# EasyEDA Pro project glimmer.epro, schematic Inputs
Board Name: Inputs; Create Date: 2026-05-20; Page Name: Inputs; Project Name: glimmer; Schematic Name: Inputs; Update Date: 2026-05-20; Company: EasyEDA.com; Page Size: A4; Version: V1.0
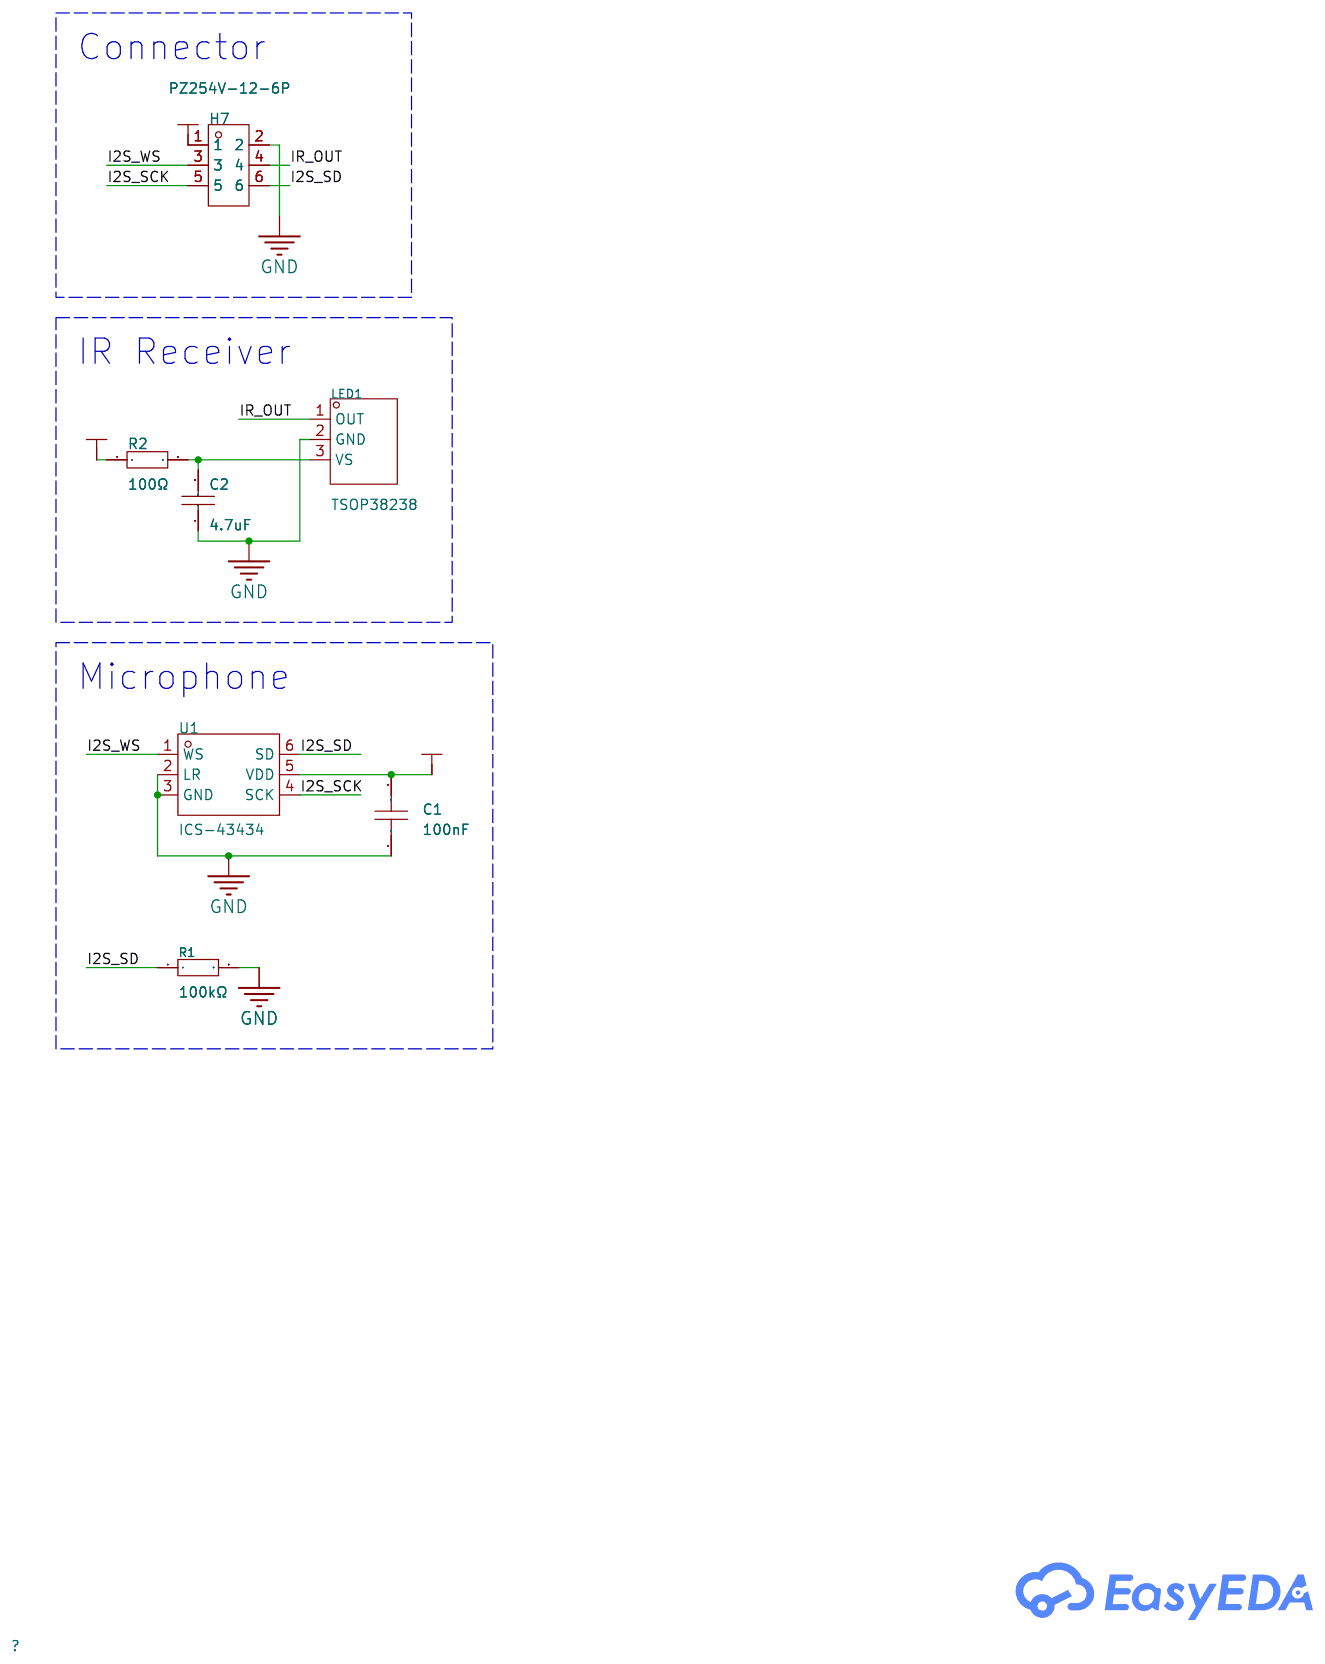
[diagram p1: schematic sheet]

## Parts
C1  100nF  [C0805]
C2  4.7uF  [C0805]
H7  PZ254V-12-6P  [HDR-TH_6P-P2.54-V-M-R2-C3-S2.54]
LED1  TSOP38238  [SENSOR-TG_TSOP38236]
R1  100kΩ  [R0805]
R2  100Ω  [R0805]
U1  ICS-43434  [MIC-SMD_6P-L3.5-W2.7-P0.90-BL]

## Library data of the parts
C1 = CC0805KRX7R9BB104: Capacitance:100nF Tolerance:±10% Tolerance:±10% Voltage Rating:50V Temperature Coefficient:X7R; LCSC Part Name: 100nF ±10% 50V; Supplier Part: C49678; Manufacturer: YAGEO(国巨); Supplier Footprint: 0805; JLCPCB Part Class: Basic Part; Datasheet: https://item.szlcsc.com/datasheet/CC0805KRX7R9BB104/50686.html; Supplier: LCSC; Tolerance: ±10%; Voltage Rating: 50V; Temperature Coefficient: X7R
C2 = CL21A475KAQNNNE: Capacitance:4.7uF Tolerance:±10% Tolerance:±10% Voltage Rating:25V Temperature Coefficient:X5R; LCSC Part Name: 4.7uF ±10% 25V; Supplier Part: C1779; Manufacturer: SAMSUNG(三星); Supplier Footprint: 0805; JLCPCB Part Class: Basic Part; Datasheet: https://item.szlcsc.com/datasheet/CL21A475KAQNNNE/2131.html; Supplier: LCSC; Tolerance: ±10%; Voltage Rating: 25V; Temperature Coefficient: X5R
H7 = PZ254V-12-6P: Pin Structure:2x3P Pitch:2.54mm Row Spacing:2.54mm Circluar Pins/Square Pins:Square Pins Mounting Type:Straight Number of Rows:双排 Number of Pins:6P Current Rating (Max):- Voltage Rating (Max):- Length of Mating Pin:6mm Insulation Height:2.5mm Length of En; LCSC Part Name: 间距:2.54mm 2x3P 直插 方针; Supplier Part: C492420; Manufacturer: XFCN(兴飞); Supplier Footprint: 插件,P=2.54mm; JLCPCB Part Class: Extended Part; Datasheet: https://atta.szlcsc.com/upload/public/pdf/source/20200309/C492420_BAECB307B001054C09D200388220EAE6.pdf; Supplier: LCSC; Pin Structure: 2x3P; Pitch: 2.54mm; Row Spacing: 2.54mm; Circluar Pins/Square Pins: Square Pins; Mounting Type: Straight; Number of Rows: 双排; Number of Pins: 6P; Length of Mating Pin: 6mm; Insulation Height: 2.5mm; Length of End Connection Pin: 3mm; Operating Temperature Range: -40℃~+105℃; Color: Black
LED1 = TSOP38238: Voltage - Supply:2.5V~5.5V Voltage - Supply:2.5V~5.5V Current - Supply:350uA Transmission Distance:45m Frequency - Center:38kHz Viewing Angle:±45° Pd - Power Dissipation:10mW Operating Temperature:-25℃~+85℃ Operating Temperature:-25℃~+85℃; LCSC Part Name: 接收距离45m ±45°; Supplier Part: C141632; Manufacturer: VISHAY(威世); Supplier Footprint: SIP-3-2.54mm; JLCPCB Part Class: Extended Part; Datasheet: https://item.szlcsc.com/datasheet/TSOP38238/152963.html; Supplier: LCSC; Voltage - Supply: 2.5V~5.5V; Current - Supply: 350uA; Transmission Distance: 45m; Frequency - Center: 38kHz; Viewing Angle: ±45°; Pd - Power Dissipation: 10mW; Operating Temperature: -25℃~+85℃
R1 = 0805W8F1003T5E: Type:Thick Film Resistor Resistance:100kΩ Tolerance:±1% Tolerance:±1% Power(Watts):125mW Voltage-Supply(Max):150V Temperature Coefficient:±100ppm/℃ Temperature Coefficient:±100ppm/℃ Operating Temperature:-55℃~+155℃ Operating Temperature:-55℃~+155℃; LCSC Part Name: 100kΩ ±1% 125mW 厚膜电阻; Supplier Part: C149504; Manufacturer: UNI-ROYAL(厚声); Supplier Footprint: 0805; JLCPCB Part Class: Basic Part; Datasheet: https://item.szlcsc.com/datasheet/0805W8F1003T5E/160838.html; Supplier: LCSC; Type: Thick Film Resistor; Tolerance: ±1%; Power(Watts): 125mW; Voltage-Supply(Max): 150V; Temperature Coefficient: ±100ppm/℃; Operating Temperature: -55℃~+155℃
R2 = 0805W8F1000T5E_C17408: Type:Thick Film Resistors Resistance: Tolerance:±1% Tolerance:±1% Power(Watts): Overload Voltage (Max): Temperature Coefficient:±100ppm/℃ Temperature Coefficient:±100ppm/℃ Operating Temperature Range:-55℃~+155℃ Operating Temperature Range:-55℃~+155℃; LCSC Part Name: 100Ω ±1% 125mW 厚膜电阻; Supplier Part: C17408; Manufacturer: UNI-ROYAL(厚声); Manufacturer Part: 0805W8F1000T5E; Supplier Footprint: 0805; JLCPCB Part Class: Basic Part; Datasheet: https://atta.szlcsc.com/upload/public/pdf/source/20200306/C422600_1E6D84923E4A46A82E41ADD87F860B5C.pdf; Supplier: LCSC; Type: Thick Film Resistors; Tolerance: ±1%; Temperature Coefficient: ±100ppm/℃; Operating Temperature Range: -55℃~+155℃
U1 = ICS-43434_C5656610: Direction:Omnidirectional Voltage - Supply:1.65V~3.63V Voltage - Supply:1.65V~3.63V Current Consumption:550uA Current Consumption:550uA S/N Ratio:64dB Sensitivity:-26dB Sensitivity:-26dB Output Type:I2S Length:3.5mm Width:2.65mm Height:0.98mm Operating Te; LCSC Part Name: 1.65V~3.63V; Supplier Part: C5656610; Manufacturer: TDK InvenSense(应美盛); Supplier Footprint: LGA-6(3.5x2.7); JLCPCB Part Class: Extended Part; Datasheet: https://item.szlcsc.com/datasheet/ICS-43434/6577565.html; Supplier: LCSC; Direction: Omnidirectional; Voltage - Supply: 1.65V~3.63V; Current Consumption: 550uA; S/N Ratio: 64dB; Sensitivity: -26dB; Output Type: I2S; Length: 3.5mm; Width: 2.65mm; Height: 0.98mm; Operating Temperature: -40℃~+85℃; Features: Omnidirectional pickup

## Nets
3.3V: C1.1 H7.1 R2.1 U1.5(VDD)
GND: C1.2 C2.1 H7.2 LED1.2(GND) R1.2 U1.2(LR) U1.3(GND)
I2S_SCK: H7.5 U1.4(SCK)
I2S_SD: H7.6 R1.1 U1.6(SD)
I2S_WS: H7.3 U1.1(WS)
IR_OUT: H7.4 LED1.1(OUT)
$4N1369: C2.2 LED1.3(VS) R2.2

## Notes on the sheet
- Connector
- IR Receiver
- Microphone
